# EAGLE design 3g PCIe breakout (EAGLE 6.3)
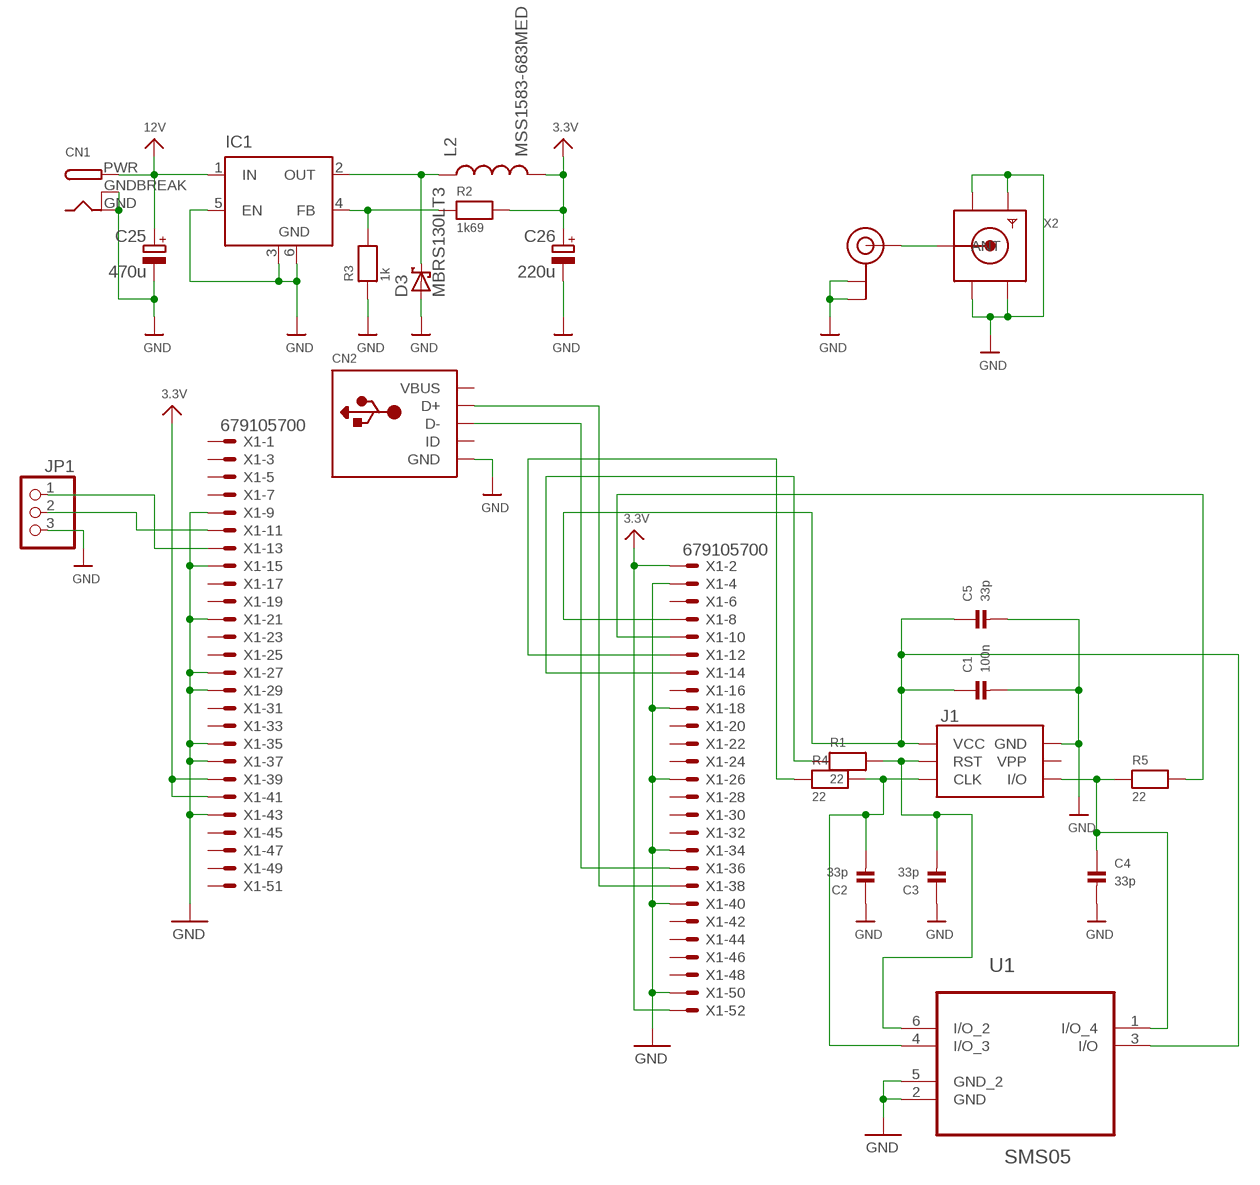
[diagram p0: schematic, sheet 1]

## Parts
C1  100n  CAP_CERAMIC_0603  [_0603]
C2  33p  CAP_CERAMIC_0603  [_0603]
C3  33p  CAP_CERAMIC_0603  [_0603]
C4  33p  CAP_CERAMIC_0603  [_0603]
C5  33p  CAP_CERAMIC_0603  [_0603]
C25  470u  CPOL-EU153CLV-1012  [153CLV-1012]
C26  220u  CPOL-EU153CLV-1012  [153CLV-1012]
CN1  DCBARRELPTH  [DCJACK_2MM_PTH]
CN2  USBMINIB  [USB-MINIB]
D3  MBRS130LT3  [SMB]
IC1  LM2596S  [TO263-5]
J1  SIMHOLDERSIM  [SIMHOLDER]
JP1  PINHD-1X3  [1X03]
L2  MSS1583-683MED  INDUCTORPWR  [CDRH125]
R1  22  RESISTOR_0603  [_0603]
R2  1k69  RESISTOR_0603  [_0603]
R3  1k  RESISTOR_0603  [_0603]
R4  22  RESISTOR_0603  [_0603]
R5  22  RESISTOR_0603  [_0603]
U1  SMS05  [SOT95P280X145-6N]
U$12  U.FL  [U.FL]
X1  679105700  [679105700]
X2  SMACONNECTOR  [SMA90_DIP]

## Nets
3.3V: C26.+ L2.2 R2.2 X1.2 X1.39 X1.41 X1.52
12V: C25.+ CN1.PWR IC1.1(IN)
GND: C1.2 C2.1 C3.1 C4.2 C5.2 C25.- C26.- CN1.GND CN1.GNDBREAK CN2.GND D3.A IC1.3(GND) IC1.5(EN) IC1.6(GND) J1.C5(GND) JP1.3 R3.1 U1.2(GND) U1.5(GND_2) U$12.1(GND) U$12.2(GND) X1.4 X1.9 X1.15 X1.18 X1.21 X1.26 X1.27 X1.29 X1.34 X1.35 X1.37 X1.40 X1.43 X1.50 X2.GND1 X2.GND2 X2.GND3 X2.GND4
N$1: CN2.D+ X1.38
N$2: CN2.D- X1.36
N$3: JP1.1 X1.13
N$4: JP1.2 X1.11
N$5: C3.2 J1.C2(RST) R1.2 U1.6(I/O_2)
N$6: D3.C IC1.2(OUT) L2.1
N$7: C2.2 J1.C3(CLK) R4.2 U1.4(I/O_3)
N$8: C4.1 J1.C7(I/O) R5.1 U1.1(I/O_4)
N$9: IC1.4(FB) R2.1 R3.2
N$10: C1.1 C5.1 J1.C1(VCC) U1.3(I/O) X1.8
N$11: R5.2 X1.10
N$12: R1.1 X1.14
N$13: R4.1 X1.12
N$14: U$12.3(SIGNAL) X2.ANTENNA(ANT)
Unconnected: CN2.ID J1.C6(VPP) X1.1 X1.3 X1.5 X1.6 X1.7 X1.16 X1.17 X1.19 X1.20 X1.22 X1.23 X1.24 X1.25 X1.28 X1.30 X1.31 X1.32 X1.33 X1.42 X1.44 X1.45 X1.46 X1.47 X1.48 X1.49 X1.51

## Power pins joined to a net without a drawn wire
VBUS: CN2.VBUS

## Library data of the parts
C1-C5 = microbuilder:CAP_CERAMIC: Ceramic Capacitors 0402 - 0402 Surface Mount Capacitors 16pF 50V 5% [Digikey: 445-4899-2-ND] 18pF 50V 5% [Digikey: 490-1281-2-ND] 22pF 50V 5% [Digikey: 490-1283-2-ND] 68pF 50V 5% [Digikey: 490-1289-2-ND] 0.1uF 10V 10% [Digikey: 490-1318-2-ND] 1.0uF 6.3V 10% [Digikey: 490-1320-2-ND] 0603 - 0603 Surface Mount Capacitors 16 pF 50V 5% [Digikey: 445-5051-2-ND] 22 pF 50V [Digikey: PCC220ACVTR-ND] 33 pF 50V 5% [Digikey: 490-1415-1-ND] 56pF 50V 5% [Digikey: 490-1421-1-ND] 220pF 50V 5% [Digikey: 445-1285-1-ND] 680 pF 50V 2200 pF 50V 5% C0G [Digikey: 445-1297-1-ND] 5600 pF 100V 5% X7R [Digikey: 478-3711-1-ND] 0.1 µF 25V 10% [Digikey: PCC2277TR-ND] 0.22 µF 16V 10% X7R [Digikey: 445-1318-1-ND] 1.0 µF 25V 10% [Digikey: 445-5146-2-ND] 0603 - RF Specific 3pF 250V +/-0.1pF RF [Digikey: 712-1347-1-ND] 18 pF 250V 5% [Digikey: 478-3505-1-ND or 712-1322-1-ND] 56 pF 250V 5% C0G RF [Digikey: 490-4867-1-ND] 68 pF 250V RF [Digikey: 490-4868-1-ND] 0805 - 0805 Surface Mount Capacitors 220 pF 250V 2% RF Ceramic Capacitor [Digikey: 712-1398-1-ND] 1000 pF 50V 2% NP0 Ceramic Capacitor [Digikey: 478-3760-1-ND] 0.1 µF 25V 10% Ceramic Capacitor [Digikey: PCC1828TR-ND] 1.0 µF 16V 10% Ceramic Capacitor[Digikey: 490-1691-2-ND] 10.0 µF 10V 10% Ceramic Capacitor[Digikey: 709-1228-1-ND] 10.0 uF 16V 10% Ceramic Capacitor [Digikey: 478-5165-2-ND] 47 uF 6.3V 20% Ceramic Capacitor [Digikey: 587-1779-1-ND or 399-5506-1-ND] 1206 - 1206 Surface Mount Capacitors 47uF 10V 20% Ceramic Capacitor [Digikey: 490-5528-1-ND or 399-5508-1-ND or 445-6010-1-ND] 100uF 6.3V -20%, +80% Y5V Ceramic Capacitor (Digikey: 490-4512-1-ND, Mouser: 81-GRM31CF50J107ZE1L)
C25 C26 = rcl:CPOL-EU: POLARIZED CAPACITOR, European symbol
CN1 = adafruit:DCBARREL: 2.0mm DC Barrel Jack DCJACK_2MM_PTH - Through Hole Jack (4UConnector: 05537)
CN2 = adafruit:USB: USB Connectors USBMINIB - Surface Mount Female Mini-B USB Connector 4UConnector: 06564 By microbuilder.eu Thru-hole RA Female Mini-B USB Connector 4UConnector: 18732 By ladyada.net
D3 = diode:MBRS130LT3: Schottky Power Rectifier Source: http://www.onsemi.com/pub/Collateral/MBRS130LT3-D.PDF
IC1 = linear:LM2596S: STEP-DOWN VOLTAGE REGULATOR
J1 = SparkFun-Connectors:SIMHOLDER: SIM Socket Socket for SIM cellular cards. Schematic element and footprint production proven. Spark Fun Electronics SKU : PRT-00548; PROD_ID: CONN-08536
JP1 = adafruit:PINHD-1X3: PIN HEADER
L2 = SparkFun-Passives:INDUCTOR: Inductors Basic Inductor/Choke - 0603 and 1206. Footprints are not proven and vary greatly between part numbers. INDUCTOR POWER 3.3UH 4.0A SMD 0.197" L x 0.197" W x 0.177" H (5.00mm x 5.00mm x 4.50mm)
R1-R5 = microbuilder:RESISTOR: Resistors 0402 - 0402 Surface Mount Package 22 Ohm 1% 1/16W [Digikey: 311-22.0LRTR-ND] 33 Ohm 5% 1/16W 1.0K 5% 1/16W 1.5K 5% 1/16W 2.0K 1% 1/16W 10.0K 1% 1/16W [Digikey: 311-10.0KLRTR-ND] 10.0K 5% 1/16W [Digikey: RMCF0402JT10K0TR-ND] 12.1K 1% 1/16W [Digikey: 311-22.0LRTR-ND] 100.0K 5% 1/16W 0603 - 0603 Surface Mount Package 0 Ohm 1/10 Watt 1% Resistor 15 Ohm 1/10 Watt 1% Resistor 33 Ohm 1/10 Watt 1% Resistor 49.9 Ohm 1/10 Watt 1% Resistor 100 Ohm 1/10 Watt 1% Resistor 150 Ohm 1/10 Watt 1% Resistor 240 Ohm 1/10 Watt 1% Resistor 390 Ohm 1/10 Watt 1% Resistor 560 Ohm 1/10 Watt 1% Resistor 680 Ohm 1/10 Watt 1% Resistor 750 Ohm 1/10 Watt 1% Resistor 1.0K Ohm 1/10 Watt 1% Resistor 1.5K Ohm 1/10 Watt 1% Resistor 2.0K Ohm 1/10 Watt 1% Resistor 2.2K Ohm 1/10 Watt 1% Resistor 3.3K Ohm 1/10 Watt 1% Resistor 4.7K Ohm 1/10 Watt 1% Resistor 10.0K Ohm 1/10 Watt 1% Resistor 12.0K Ohm 1/10 Watt 1% Resistor 12.1K Ohm 1/10 Watt 1% Resistor 20.0K Ohm 1/10 Watt 1% Resistor 33.0K Ohm 1/10 Watt 1% Resistor 100.0K Ohm 1/10 Watt 1% Resistor 0805 - 0805 Surface Mount Package 0 Ohm 1/8 Watt 1% Resistor 33 Ohm 1/8 Watt 1% Resistor 100 Ohm 1/8 Watt 1% Resistor 150 Ohm 1/8 Watt 1% Resistor 200 Ohm 1/8 Watt 1% Resistor 240 Ohm 1/8 Watt 1% Resistor 330 Ohm 1/8 Watt 1% Resistor 390 Ohm 1/8 Watt 1% Resistor 470 Ohm 1/8 Watt 1% Resistor 1.0K Ohm 1/8 Watt 1% Resistor 1.5K Ohm 1/8 Watt 1% Resistor 2.0K Ohm 1/8 Watt 1% Resistor 4.7K Ohm 1/8 Watt 1% Resistor 5.1K Ohm 1/8 Watt 1% Resistor 5.6K Ohm 1/8 Watt 1% Resistor 10.0K Ohm 1/8 Watt 1% Resistor 22.0K Ohm 1/8 Watt 1% Resistor 33.0K Ohm 1/8 Watt 1% Resistor 100K Ohm 1/8 Watt 1% Resistor 1206 - 1206 Surface Mount Package 2012 - 2010 Surface Mount Package 0.11 Ohm 1/2 Watt 1% Resistor - Digikey: RHM.11UCT-ND
U1 = SMS05:SMS05: TVS DIODE; MPN: SMS05; OC_FARNELL: 2059036; OC_NEWARK: 64T4092; PACKAGE: SOT-23-6; SUPPLIER: SEMTECH
U$12 = microbuilder:U.FL: U.FL Antenna Connector
X1 = con-molex:679105700: MINI PCI EXPRESS CONNECTOR 0.8MM PITCH, 52 CIRCUIT Source: http://www.molex.com/pdm_docs/sd/679105700_sd.pdf; MPN: 67910-5700; OC_FARNELL: unknown; OC_NEWARK: 93M2128
X2 = adafruit:SMACONNECTOR: SMA Connector 90° DIP SMA Connector, 50 Ohm (4UConnector: 07259)

## Board
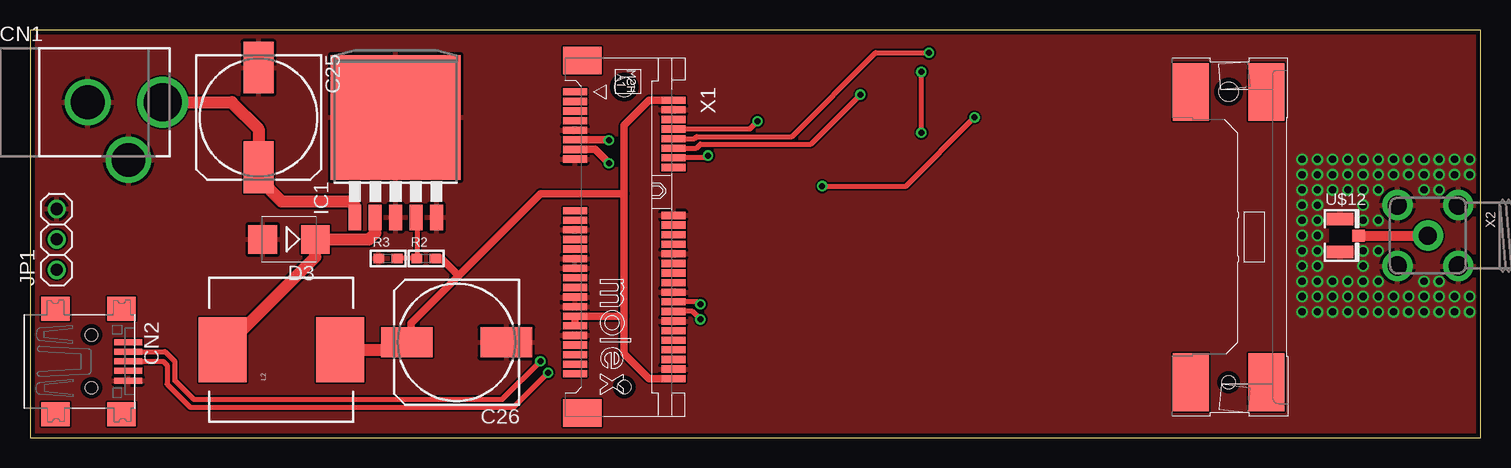
[diagram p1: board, top side]
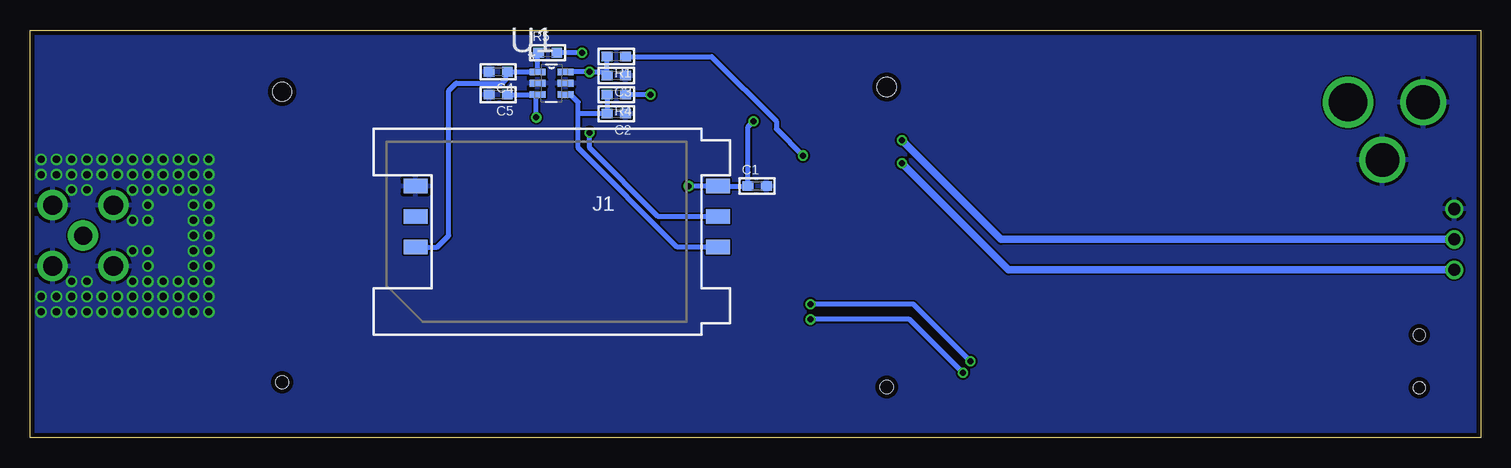
[diagram p2: board, bottom side, seen from below]

Size 120.95 x 33.96 mm. Coordinates in mm from the lower left corner, seen from the top.
Outline: 0,0 120.95,0 120.95,33.96 0,33.96 0,0
Copper layers (1*16): Top 0.0356mm / dielectric 1.5011mm / Bottom 0.0356mm
Design rules "LaenPCBOrder": minimum track width 6mil, minimum drill 13mil, track to track 6mil, track to pad 6mil, pad to pad 6mil, via to via 6mil, smd to smd 6mil, copper to edge 15mil, drill to drill 6mil, minimum pad ring 7mil, minimum via ring 7mil, stop-mask expansion 3mil, vias tented up to drill 0mil, thermal gap 10mil

### Footprints (pad centres in the part's own frame; a part is rotated, then mirrored left to right if it is on the bottom)
_0603 = smd 0.9 x 0.8: 1 -0.762,0; 2 0.762,0
153CLV-1012 = smd 4.3 x 2.5: + 4.15,0; - -4.15,0
DCJACK_2MM_PTH = drill 2.8: GND 0,7.35; GNDBREAK 4.8,10.75 | drill 3.2: PWR 0,13.6
USB-MINIB = smd 0.5 x 2.308: D+ 0,4.064; D- -0.8,4.064; GND 1.6,4.064; ID 0.8,4.064; VBUS -1.6,4.064 | smd 2 x 2.4: GND1 -4.4,-2; GND2 -4.4,3.5; GND3 4.4,3.5; GND4 4.4,-2 | hole 1: -2.2,1; 2.2,1
SMB = smd 2.4 x 2.4: A 2.2,0; C -2.2,0
TO263-5 = smd 1.067 x 2.159: 1 -3.404,-5.791; 2 -1.702,-5.791; 3 0,-5.791; 4 1.702,-5.791; 5 3.404,-5.791 | smd 10.8 x 10.41: 6 0,2.54
SIMHOLDER = smd 2 x 1.2: C1 -12.61,-3.81; C2 -12.61,-1.27; C3 -12.61,1.27; C5 12.61,-3.81; C6 12.61,-1.27; C7 12.61,1.27
1X03 = drill 1.016: 1 -2.54,0; 2 0,0; 3 2.54,0
CDRH125 = smd 5.4 x 4: 1 0,4.9; 2 0,-4.9
SOT95P280X145-6N = smd 1.321 x 0.559: 1 -1.168,0.94; 2 -1.168,0; 3 -1.168,-0.94; 4 1.168,-0.94; 5 1.168,0; 6 1.168,0.94
U.FL = smd 2.2 x 1.05: 1 0,1.375; 2 0,-1.375 | smd 1.05 x 1: 3 1.525,0
679105700 = smd 0.6 x 2: 1 0.4,-4.1; 2 1.1,4.1; 3 1.2,-4.1; 4 1.9,4.1; 5 2,-4.1; 6 2.7,4.1; 7 2.8,-4.1; 8 3.5,4.1; 9 3.6,-4.1; 10 4.3,4.1; 11 4.4,-4.1; 12 5.1,4.1; 13 5.2,-4.1; 14 5.9,4.1; 15 6,-4.1; 16 6.7,4.1; 17 10.3,-4.1; 18 10.7,4.1; 19 11.1,-4.1; 20 11.5,4.1; 21 11.9,-4.1; 22 12.3,4.1; 23 12.7,-4.1; 24 13.1,4.1; 25 13.5,-4.1; 26 13.9,4.1; 27 14.3,-4.1; 28 14.7,4.1; 29 15.1,-4.1; 30 15.5,4.1; 31 15.9,-4.1; 32 16.3,4.1; 33 16.7,-4.1; 34 17.1,4.1; 35 17.5,-4.1; 36 17.9,4.1; 37 18.3,-4.1; 38 18.7,4.1; 39 19.1,-4.1; 40 19.5,4.1; 41 19.9,-4.1; 42 20.3,4.1; 43 20.7,-4.1; 44 21.1,4.1; 45 21.5,-4.1; 46 21.9,4.1; 47 22.3,-4.1; 48 22.7,4.1; 49 23.1,-4.1; 50 23.5,4.1; 51 23.9,-4.1; 52 24.3,4.1 | smd 2.3 x 3.2: M1 27.15,-3.5; M2 -2.2,-3.5 | smd 4.8 x 3: M3 0.4,47.25; M4 0.4,53.55; M5 24.6,47.25; M6 24.6,53.55 | hole 1.6: 0,0; 0.4,50.4 | hole 1.1: 25,0; 24.6,50.4
SMA90_DIP = drill 1.5 pad 2.54: ANTENNA 0,0 | drill 1.6 pad 2.54: GND1 -2.54,2.54; GND2 2.54,2.54; GND3 -2.54,-2.54; GND4 2.54,-2.54

### Placement (x,y rotation side)
C1  60.33,20.95 0 bottom
C2  72.07,26.99 180 bottom
C3  72.07,30.16 180 bottom
C4  81.92,30.48 180 bottom
C5  81.92,28.57 180 bottom
C25  19.05,26.67 270 top
C26  35.56,7.94 180 top
CN1  -2.54,27.94 270 top
CN2  4.13,6.35 270 top
D3  21.59,16.51 180 top
IC1  30.48,24.13 0 top
J1  76.2,17.14 180 bottom
JP1  2.22,16.51 90 top
L2  20.95,7.3 90 top
R1  72.07,31.75 180 bottom
R2  33.02,14.92 0 top
R3  29.84,14.92 0 top
R4  72.07,28.57 180 bottom
R5  77.79,32.07 0 bottom
U1  77.47,29.53 0 bottom
U$12  109.22,16.83 0 top
X1  49.53,29.21 270 top
X2  116.52,16.83 270 top

### Tracks (layer width: path | path; a pad name or v marks a point on that pad's centre or on a via)
3.3V
  Top 0.61: X1.2 51.6,28.11 49.53,26.04 49.53,20.32 | 49.53,10.11 X1.39 X1.41 | 49.53,10.11 49.53,20.32 | X1.52 51.6,4.91 49.53,6.99 49.53,10.11 | 49.53,20.32 42.55,20.32 35.72,13.49 | 35.72,13.49 31.75,9.53 31.75,8.28 C26.+ | R2.2 34.29,14.92 35.72,13.49
  Top 1.016: L2.2 31.43,7.3 32.07,7.94 C26.+
12V
  Top 1.016: CN1.PWR 16.83,27.94 19.05,25.72 C25.+ 19.05,21.59 20.95,19.68 26.67,19.68 27.08,19.28 IC1.1
GND  (via drill 0.6)
  other vias: 120.02,21.91 118.75,21.91 117.47,21.91 116.2,21.91 114.94,21.91 113.67,21.91 112.39,21.91 111.12,21.91 109.86,21.91 108.58,21.91 107.31,21.91 107.31,20.64 107.31,19.37 107.31,18.1 107.31,16.83 107.31,15.56 107.31,14.29 107.31,13.02 107.31,11.75 108.58,11.75 109.86,11.75 111.12,11.75 112.39,11.75 113.67,11.75 114.94,11.75 116.2,11.75 117.47,11.75 118.75,11.75 120.02,11.75 117.47,13.02 116.2,13.02 112.39,13.02 111.12,13.02 109.86,13.02 108.58,13.02 111.12,14.29 111.12,15.56 112.39,15.56 112.39,18.1 111.12,18.1 111.12,19.37 111.12,20.64 109.86,20.64 108.58,20.64 117.47,20.64 116.2,20.64 112.39,20.64 120.02,23.18 118.75,23.18 117.47,23.18 116.2,23.18 114.94,23.18 113.67,23.18 112.39,23.18 111.12,23.18 109.86,23.18 108.58,23.18 107.31,23.18 106.05,23.18 106.05,21.91 106.05,20.64 106.05,19.37 106.05,18.1 106.05,16.83 106.05,15.56 106.05,14.29 106.05,13.02 106.05,11.75 106.05,10.48 107.31,10.48 108.58,10.48 109.86,10.48 111.12,10.48 112.39,10.48 113.67,10.48 114.94,10.48 116.2,10.48 117.47,10.48 118.75,10.48 120.02,10.48
  pour Top: 0,34.29 120.97,34.29 120.97,0 0,0
  pour Bottom: 0,33.97 120.97,33.97 120.97,0 0,0
N$1  (via drill 0.5)
  Top 0.406: CN2.D+ 11.11,6.35 11.43,6.03 11.43,4.45 13.34,2.54 40.32,2.54 v43.18,5.4 | v55.88,9.84 55.21,10.51 X1.38
  Bottom 0.406: v43.18,5.4 47.62,9.84 v55.88,9.84
N$2  (via drill 0.5)
  Top 0.406: CN2.D- 11.27,7.15 12.06,6.35 12.06,4.76 13.65,3.17 39.37,3.17 v42.55,6.35 | v55.88,11.11 55.68,11.31 X1.36
  Bottom 0.406: v42.55,6.35 47.31,11.11 v55.88,11.11
N$3  (via drill 0.5)
  Top 0.61: v48.26,22.86 47.11,24.01 X1.13
  Bottom 0.61: JP1.1 39.37,13.97 v48.26,22.86
N$4  (via drill 0.5)
  Top 0.61: v48.26,24.77 48.22,24.81 X1.11
  Bottom 0.61: JP1.2 40.01,16.51 v48.26,24.77
N$5  (via drill 0.5)
  Top 0.406: v74.3,25.4 v74.3,30.47
  Bottom 0.406: J1.C2 68.58,18.41 74.3,24.13 v74.3,25.4 | R1.2 C3.2 73.14,30.47 v74.3,30.47 U1.6
N$6
  Top 1.016: IC1.2 28.78,17.03 28.26,16.51 D3.C 23.79,15.04 L2.1
N$7
  Bottom 0.406: J1.C3 66.99,15.88 75.25,24.13 75.25,26.99 | R4.2 C2.2 75.25,26.99 | 75.25,26.99 75.25,27.94 75.88,28.57 76.29,28.57 U1.4
N$8
  Bottom 0.406: J1.C7 87,15.88 86.04,16.83 86.04,28.89 85.41,29.53 81.6,29.53 81.28,29.84 81.28,30.35 C4.1 U1.1 78.64,31.98 R5.1
N$9
  Top 0.406: IC1.4 32.26,18.26 R2.1 R3.2
N$10  (via drill 0.5)
  Top 0.406: X1.8 60.01,25.72 v60.64,26.35 | v66.04,20.95 73.03,20.95 v78.74,26.67
  Bottom 0.406: v60.64,26.35 61.09,25.91 C1.1 J1.C1 v66.04,20.95 | C5.1 78.65,28.57 U1.3 78.74,28.49 v78.74,26.67
N$11  (via drill 0.5)
  Top 0.406: X1.10 55.39,24.91 55.56,25.08 63.5,25.08 70.48,32.07 v74.93,32.07
  Bottom 0.406: v74.93,32.07 R5.2
N$12  (via drill 0.5)
  Top 0.406: v56.52,23.5 56.33,23.31 X1.14
  Bottom 0.406: R1.1 64.14,31.75 58.74,26.35 58.74,25.72 v56.52,23.5
N$13  (via drill 0.5)
  Top 0.406: X1.12 55.54,24.11 55.88,24.45 65.09,24.45 v69.22,28.57
  Bottom 0.406: v69.22,28.57 R4.1
N$14
  Top 0.813: U$12.3 X2.ANTENNA